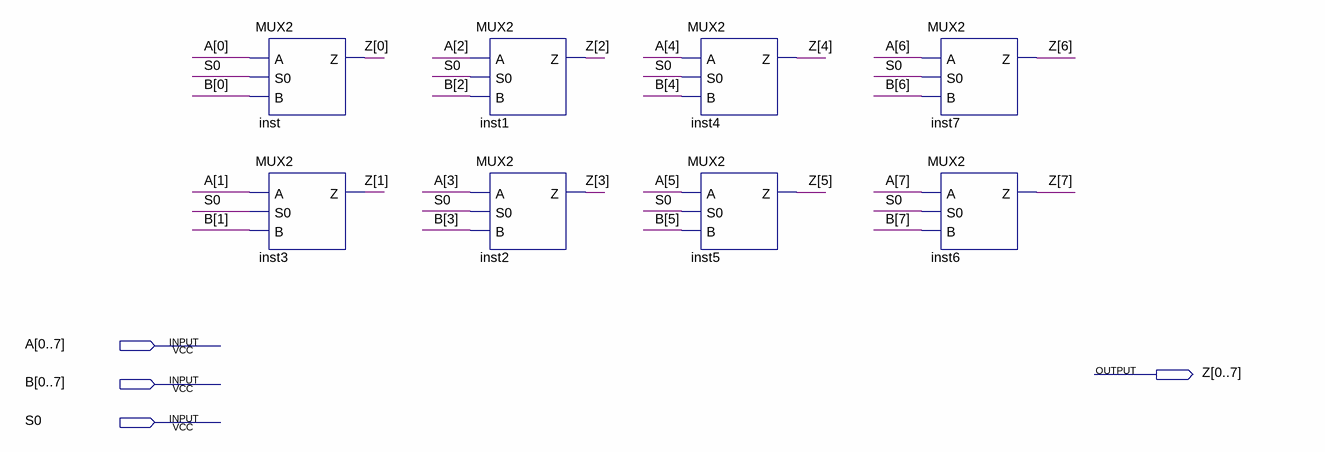
[diagram p0: schematic sheet]
// Quartus schematic lab02.bdf as structural Verilog: 8 symbols, 4 pins
module lab02 (
  input  [0:7] A,
  input  [0:7] B,
  input  S0,
  output [0:7] Z
);

  MUX2 inst (.A(A[0]), .S0(S0), .B(B[0]), .Z(Z[0]));
  MUX2 inst3 (.A(A[1]), .S0(S0), .B(B[1]), .Z(Z[1]));
  MUX2 inst1 (.A(A[2]), .S0(S0), .B(B[2]), .Z(Z[2]));
  MUX2 inst2 (.A(A[3]), .S0(S0), .B(B[3]), .Z(Z[3]));
  MUX2 inst4 (.A(A[4]), .S0(S0), .B(B[4]), .Z(Z[4]));
  MUX2 inst5 (.A(A[5]), .S0(S0), .B(B[5]), .Z(Z[5]));
  MUX2 inst7 (.A(A[6]), .S0(S0), .B(B[6]), .Z(Z[6]));
  MUX2 inst6 (.A(A[7]), .S0(S0), .B(B[7]), .Z(Z[7]));
endmodule
